# EasyEDA Pro project 通用ARM32位处理器开发板.epro, board PCB1
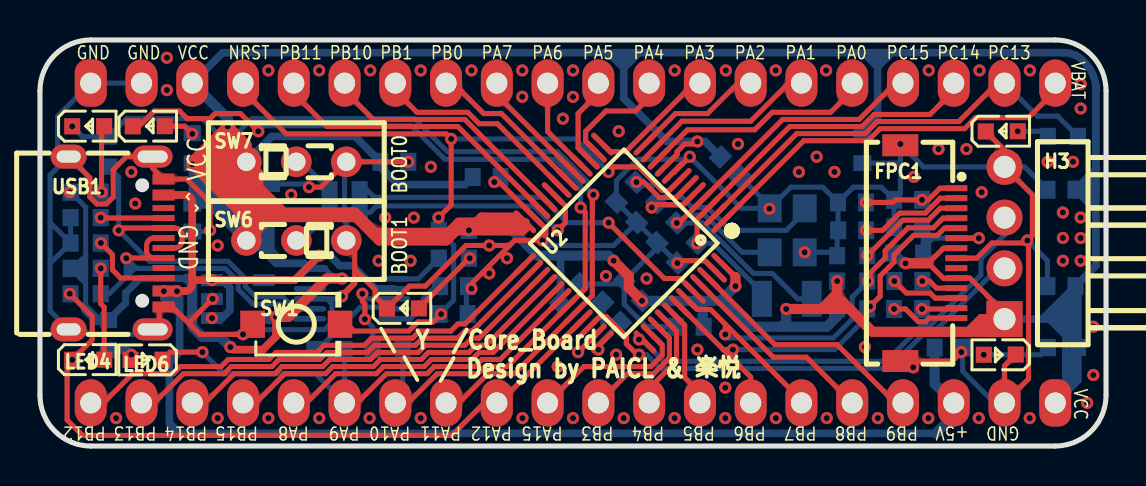
[diagram p1: board, top side]
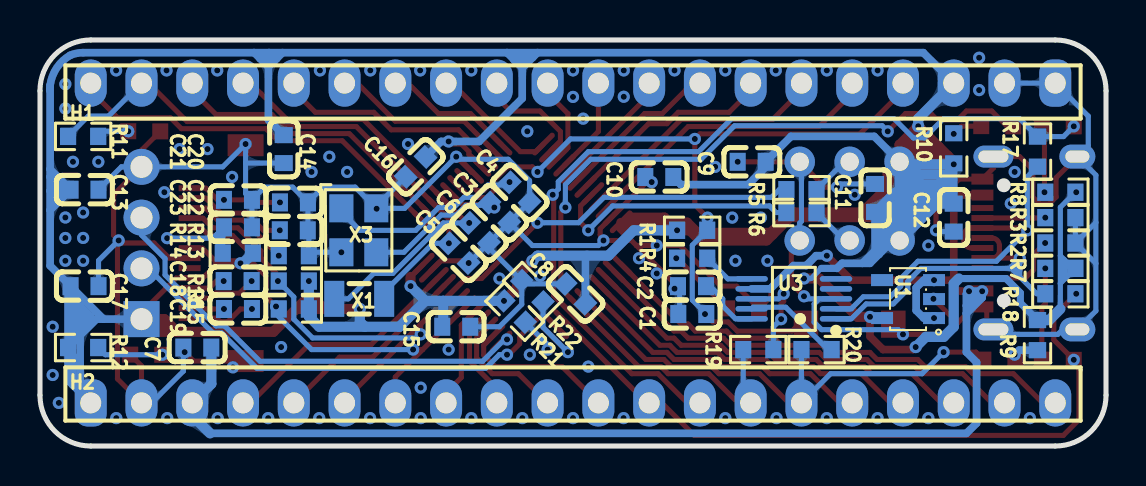
[diagram p2: board, bottom side, seen from below]

Outline 53.34 x 20.32 mm; copper layers: Top Layer, Bottom Layer. Coordinates in mm from the lower left corner of the outline.
Outline path: 0,17.78 0,2.54 arc(0.74,0.74) 2.54,0 50.8,0 arc(52.6,0.74) 53.34,2.54 53.34,17.78 arc(52.6,19.58) 50.8,20.32 2.54,20.32 arc(0.74,19.58) 0,17.78
Stack: Top Layer 0.035mm / Dielectric1 1.51mm FR4 er 4.5 / Bottom Layer 0.035mm

## Design rules (mm)
template: JLCPCB Capability(Two Layers Board)
spacing copperThickness1oz (default): track to track 0.102, other pairs 0.152 to 0.3
spacing copperThickness2oz: track to track 0.203, other pairs 0.152 to 0.3
track width copperThickness1oz (default): min 0.127, default 0.254, max 2.54
track width copperThickness2oz: min 0.203, default 0.254, max 2.54
differential pair differentialPair (default): width min 0.127, default 0.254, max 2.54; gap min 0.152, default 0.152
via viaSize (default): diameter min 0.5, default 0.61, max 10; hole min 0.3, default 0.305, max 6.3

## Placement (name value [footprint] x y rotation side)
C1  100nF  [C0603]  20.7 6.61 180 bottom
C2  100nF  [C0603]  20.72 8 0 bottom
C3  20pF  [C0603]  30.35 11.68 45 bottom
C4  20pF  [C0603]  29.34 12.7 45 bottom
C5  20pF  [C0603]  32.38 9.65 45 bottom
C6  20pF  [C0603]  31.37 10.67 45 bottom
C7  2.2uF  [C0603]  45.47 4.93 180 bottom
C8  2.2uF  [C0603]  26.54 7.62 45 bottom
C9  1uF  [C0603]  17.73 14.22 0 bottom
C10  1uF  [C0603]  22.35 13.46 180 bottom
C11  100nF  [C0603]  11.56 12.41 270 bottom
C12  100nF  [C0603]  7.62 11.43 270 bottom
C13  100nF  [C0603]  51.11 12.83 180 bottom
C14  100nF  [C0603]  41.14 14.86 270 bottom
C15  100nF  [C0603]  32.51 5.97 180 bottom
C16  100nF  [C0603]  34.54 13.97 315 bottom
C17  100nF  [C0603]  51.11 8 180 bottom
C18  1uF  [C0603]  43.45 8.25 0 bottom
C19  1uF  [C0603]  43.43 6.86 180 bottom
C20  4.7uF  [C0603]  40.63 12.19 180 bottom
C21  100nF  [C0603]  43.43 12.32 0 bottom
C22  2.2uF  [C0603]  40.64 10.8 0 bottom
C23  4.7uF  [C0603]  43.43 10.94 0 bottom
FPC1  FPC-05F-14PH15  [FPC-SMD_14P-P0.50_XUNPU_FPC-05F-14PH15]  44.45 9.65 270 top
H1  X6511WV-20H-C60D30  [hdr-th_20p-p2.54-v-m]  26.67 17.78 0 bottom
H2  X6511WV-20H-C60D30  [hdr-th_20p-p2.54-v-m]  26.67 2.54 180 bottom
H3  PZ254R-11-04P  [HDR-TH_4P-P2.54-H-M-W10.4]  48.26 10.16 90 top
LED1  XL-1608SURC-06  [LED0603-RD_RED]  48.02 4.57 180 top
LED2  XL-1608SURC-06  [LED0603-RD_RED]  48.12 15.75 0 top
LED3  XL-1608SURC-06  [LED0603-RD_RED]  18.16 6.88 0 top
LED4  XL-1608SURC-06  [LED0603-RD_RED]  2.41 4.32 0 top
LED5  XL-1608SURC-06  [LED0603-RD_RED]  2.41 16 0 top
LED6  XL-1608SURC-06  [LED0603-RD_RED]  5.33 4.32 180 top
LED7  XL-1608SURC-06  [LED0603-RD_RED]  5.44 16 0 top
R1  10kΩ  [R0603]  20.71 10.8 0 bottom
R2  5.1kΩ  [R0603]  2.29 10.16 180 bottom
R3  5.1kΩ  [R0603]  2.29 11.43 180 bottom
R4  510Ω  [R0603]  20.71 9.4 180 bottom
R5  10kΩ  [R0603]  15.24 12.83 180 bottom
R6  10kΩ  [R0603]  15.24 11.68 0 bottom
R7  10kΩ  [R0603]  2.29 8.89 180 bottom
R8  10kΩ  [R0603]  2.29 12.7 180 bottom
R9  10kΩ  [R0603]  3.43 5.55 90 bottom
R10  10kΩ  [R0603]  7.62 14.9 270 bottom
R11  10kΩ  [R0603]  51.18 15.49 0 bottom
R12  10kΩ  [R0603]  51.18 4.93 0 bottom
R13  560kΩ  [R0603]  40.64 9.53 180 bottom
R14  4.7kΩ  [R0603]  43.44 9.65 180 bottom
R15  4.7kΩ  [R0603]  40.64 6.86 0 bottom
R16  4.7kΩ  [R0603]  40.64 8.25 180 bottom
R17  0Ω  [R0603]  3.43 14.73 270 bottom
R18  0Ω  [R0603]  2.29 7.62 0 bottom
R19  0Ω  [R0603]  17.4 4.83 180 bottom
R20  0Ω  [R0603]  14.49 4.83 180 bottom
R21  0Ω  [R0603]  29.59 6.73 225 bottom
R22  0Ω  [R0603]  28.7 7.75 225 bottom
SW1  TS-1088R-02026  [SW-SMD_L3.9-W3.0-P4.45]  12.83 6.1 0 top
SW6  SS-12D01-G040  [SW-TH_SS-12D01-GX]  12.83 10.29 180 top
SW7  SS-12D01-G040  [SW-TH_SS-12D01-GX]  12.83 14.22 0 top
U1  SE5218ALG-LF  [SOT-23-5_L3.0-W1.7-P0.95-LS2.8-BR]  9.91 7.35 180 bottom
U2  STM32F103C8T6  [LQFP-48_L7.0-W7.0-P0.50-LS9.0-BL]  29.21 10.16 135 top
U3  CH340E  [MSOP-10_L3.0-W3.0-P0.50-LS5.0-BL]  15.62 7.37 90 bottom
USB1  TYPE-C 16PIN 2MD(073)  [USB-C-SMD_TYPE-C-6PIN-2MD-073]  3.81 10.16 270 top
X1  32.768kHz  [fc-135r_l3.2-w1.5]  37.37 7.37 180 bottom
X3  8MHz  [OSC-SMD_4P-L3.2-W2.5-BL]  37.38 10.8 270 bottom

## Footprints (pads in the part's own frame, mm; a bottom-side part is the same pattern mirrored in y, then rotated)
C0603
  rect 0.8x0.9 smd: 1(-0.7,0) 2(0.7,0)
fc-135r_l3.2-w1.5
  rect 1x1.8 smd: 1(-1.25,0) 2(1.25,0)
FPC-SMD_14P-P0.50_XUNPU_FPC-05F-14PH15
  rect 0.3x1.1 smd: 1(-3.25,1.4) 2(-2.75,1.4) 3(-2.25,1.4) 4(-1.75,1.4) 5(-1.25,1.4) 6(-0.75,1.4) 7(-0.25,1.4) 8(0.25,1.4) 9(0.75,1.4) 10(1.25,1.4) 11(1.75,1.4) 12(2.25,1.4) 13(2.75,1.4) 14(3.25,1.4)
  rect 1.1x1.8 smd: 15(5.4,-1.4) 16(-5.4,-1.4)
HDR-TH_4P-P2.54-H-M-W10.4
  rect 1.8x1.8 hole 1.1: 1(-3.81,0)
  round 1.8 hole 1.1: 2(-1.27,0) 3(1.27,0) 4(3.81,0)
hdr-th_20p-p2.54-v-m
  rrect 1.6x2.362 hole 1.05: 1(-24.13,-0.381)
  oval 1.6x2.362 hole 1.05: 2(-21.59,-0.381) 3(-19.05,-0.381) 4(-16.51,-0.381) 5(-13.97,-0.381) 6(-11.43,-0.381) 7(-8.89,-0.381) 8(-6.35,-0.381) 9(-3.81,-0.381) 10(-1.27,-0.381) 11(1.27,-0.381) 12(3.81,-0.381) 13(6.35,-0.381) 14(8.89,-0.381) 15(11.43,-0.381) 16(13.97,-0.381) 17(16.51,-0.381) 18(19.05,-0.381) 19(21.59,-0.381) 20(24.13,-0.381)
LED0603-RD_RED
  rect 0.8x0.8 smd: 1(-0.799,-0.004) 2(0.799,0.004)
LQFP-48_L7.0-W7.0-P0.50-LS9.0-BL
  oval 0.27x1.5 smd: 1(-2.75,-4.25) 2(-2.25,-4.25) 3(-1.75,-4.25) 4(-1.25,-4.25) 5(-0.75,-4.25) 6(-0.25,-4.25) 7(0.25,-4.25) 8(0.75,-4.25) 9(1.25,-4.25) 10(1.75,-4.25) 11(2.25,-4.25) 12(2.75,-4.25) 25(2.75,4.25) 26(2.25,4.25) 27(1.75,4.25) 28(1.25,4.25) 29(0.75,4.25) 30(0.25,4.25) 31(-0.25,4.25) 32(-0.75,4.25) 33(-1.25,4.25) 34(-1.75,4.25) 35(-2.25,4.25) 36(-2.75,4.25)
  oval 1.5x0.27 smd: 13(4.25,-2.75) 14(4.25,-2.25) 15(4.25,-1.75) 16(4.25,-1.25) 17(4.25,-0.75) 18(4.25,-0.25) 19(4.25,0.25) 20(4.25,0.75) 21(4.25,1.25) 22(4.25,1.75) 23(4.25,2.25) 24(4.25,2.75) 37(-4.25,2.75) 38(-4.25,2.25) 39(-4.25,1.75) 40(-4.25,1.25) 41(-4.25,0.75) 42(-4.25,0.25) 43(-4.25,-0.25) 44(-4.25,-0.75) 45(-4.25,-1.25) 46(-4.25,-1.75) 47(-4.25,-2.25) 48(-4.25,-2.75)
MSOP-10_L3.0-W3.0-P0.50-LS5.0-BL
  oval 0.28x1.62 smd: 1(-1,-2.11) 2(-0.5,-2.11) 3(0,-2.11) 4(0.5,-2.11) 5(1,-2.11) 6(1,2.11) 7(0.5,2.11) 8(0,2.11) 9(-0.5,2.11) 10(-1,2.11)
OSC-SMD_4P-L3.2-W2.5-BL
  rect 1.4x1.2 smd: 1(-1.1,-0.875) 2(1.1,-0.875) 3(1.1,0.875) 4(-1.1,0.875)
R0603
  rect 0.806x0.864 smd: 1(-0.753,0) 2(0.753,0)
SOT-23-5_L3.0-W1.7-P0.95-LS2.8-BR
  rect 1.1x0.6 smd: 1(1.3,-0.95) 2(1.3,0) 3(1.3,0.95) 4(-1.3,0.95) 5(-1.3,-0.95)
SW-SMD_L3.9-W3.0-P4.45
  rect 1.23x1.36 smd: 1(-2.185,0) 2(2.185,0)
SW-TH_SS-12D01-GX
  round 1.524 hole 0.914: 1(-2.5,0) 2(0,0) 3(2.5,0)
USB-C-SMD_TYPE-C-6PIN-2MD-073
  rect 0.55x1.1 smd: 1(-3.2,2.375) 2(-2.4,2.375) 11(2.4,2.375) 12(3.2,2.375)
  rect 0.3x1.1 smd: 3(-1.75,2.375) 4(-1.25,2.375) 5(-0.75,2.375) 6(-0.25,2.375) 7(0.25,2.375) 8(0.75,2.375) 9(1.25,2.375) 10(1.75,2.375)
  oval 1.1x2 hole 0.6x1.5: 13(-4.325,1.825) 14(4.325,1.825)
  oval 1.2x1.8 hole 0.6x1.2: 13(-4.325,-2.375) 14(4.325,-2.375)

## Nets
As in the schematic.

Pads without a net: FPC1 9; U1 4; U3 4 5; USB1 3 9

## Via types
v1: diameter 0.61, hole 0.305, Top Layer to Bottom Layer, 160 vias

## Routing (per net, layer and track width the routed paths; a pad name or vN(x,y) marks a point on that pad's centre or on a via; arc(x,y) is an arc through that point)
+5V: length 74.9
  Top Layer w0.381: USB1.2 7.25,12.56 arc(7.51,12.45) 7.62,12.19 7.62,8.34 ; v1(13.97,9.53) 12.75,8.3 v1(8.61,8.3) 7.66,8.3 arc(7.63,8.31) 7.62,8.34 ; 7.62,8.34 7.62,8.13 arc(7.51,7.86) 7.24,7.75 v1(6.86,7.75) ; v1(6.2,7.75) arc(6.19,7.75) USB1.11
  Bottom Layer w0.381: 6.26,7.75 v1(6.2,7.75) 6.2,7.42 6.98,6.63 ; 6.26,7.75 6.98,7.03 ; 6.26,7.75 v1(6.86,7.75) 6.98,7.62 6.98,7.03 ; 6.98,7.03 6.98,6.63 ; v1(8.61,6.4) 9.12,6.4 9.5,6.78 9.5,7.92 9.12,8.3 v1(8.61,8.3) ; v1(13.97,9.53) 14.51,9.53 15,9.03 15.64,9.03 16.8,7.87 U3.7 ; 6.98,6.63 6.98,4.7 6.48,4.19 6.48,1.14 6.98,0.64 44.83,0.64 ; 45.72,1.52 H2.3
  Bottom Layer w0.508: H2.3 44.77,3.11 C7.2 ; 44.83,0.64 45.72,1.52
GND: length 183.8
  Top Layer w0.254: 15.75,8.13 15.69,8.13 15.11,7.56 v1(15.11,7.49) 15.75,8.13 ; 15.75,8.13 15.75,8.67 ; 15.75,8.67 15.84,8.76 16.76,7.84 16.76,7.48 LED3.1 18.48,8 19.28,8 21.31,10.04 v1(22.48,10.04) 23.5,10.04 ; 15.75,8.67 15.75,9.87 SW6.1 ; SW1.1 10.13,5.59 8,5.59 7.43,6.16 ; 23.5,10.04 21.46,8 ; 23.5,10.04 23.75,10.29 25.02,10.29 25.31,10.58 25.31,10.88 U2.23 22.98,13.21 v1(22.73,13.21) ; v1(8.51,10.8) 8.51,12.19 7.34,13.36 USB1.1 5.64,13.91 USB1.13 4.33,14.48 3.67,13.83 3.67,12.46 3.32,12.12 2.84,12.12 2.5,12.46 2.5,13.42 USB1.13 ; 18.41,14.22 SW7.3 14.06,12.95 v1(13.46,12.95) ; U2.47 33.28,9.27 31.88,9.27 ; 49.46,10.35 49.46,3.36 H2.2 48.26,4.01 LED1.1 ; 49.46,10.35 49.66,10.54 49.66,12.57 H3.4 48.26,14.81 LED2.1 ; 49.46,10.35 49.28,10.16 47.62,10.16 46.87,9.4 FPC1.8 ; v1(32.51,14.48) 31.73,13.7 U2.8 ; v1(46.1,4.7) 45.65,4.25 FPC1.15 ; USB1.14 5.97,6.17 5.97,6.74 USB1.12 6.63,6.96 7.43,6.16 ; 7.43,6.16 v1(8.64,7.37)
  Bottom Layer w0.254: v1(38.26,9.69) 39.72,9.69 R13.2 39.89,10.74 C22.1 39.93,10.8 C20.2 ; C23.1 C21.1 ; C21.1 43.05,12.64 v1(43.05,15.11) 44.2,13.97 H3.4 49.27,13.97 C13.2 ; C21.1 42.1,12.95 40.69,12.95 C20.2 ; X3.4 36.51,12 35.04,13.47 ; X3.4 35.09,11.89 v1(32.51,14.48) 32.38,14.35 29.91,14.35 28.88,13.32 ; X3.4 37.57,12.95 39.17,12.95 C20.2 ; C1.1 21.34,6.67 21.34,7.62 v1(21.59,7.87) 21.46,8 C2.2 ; 25.02,10.29 v1(25.15,10.29) 25.4,10.03 28.7,10.03 29.86,11.19 ; v1(15.11,7.49) 14.99,7.37 14.35,7.37 ; 28.84,13.28 28.84,12.2 29.86,11.19 ; SW7.3 15.24,14.14 15.24,11.25 15.33,11.16 SW6.1 ; C17.2 50.41,9.28 v1(49.4,10.29) ; R2.2 0.51,11.18 ; R2.2 R3.2 ; R2.2 0.51,9.14 ; 0.51,11.18 0.51,13.56 USB1.13 0.89,15.03 0.89,16.51 H1.1 H1.2 ; 0.51,11.18 0.51,9.14 ; C11.1 13.3,13.11 v1(13.46,12.95) ; R22.1 29.07,8.11 27.04,8.11 ; R22.1 30.87,9.92 30.87,10.17 ; R22.1 29.23,7.09 30.35,5.97 C15.2 ; v1(8.51,10.8) 8.44,10.73 C12.2 ; 30.87,10.17 v1(31.89,9.16) ; 30.87,10.17 29.86,11.19 ; 14.35,7.37 14.6,7.11 14.6,6.2 14.23,5.82 10.4,5.82 v1(10.16,5.59) ; 14.35,7.37 U3.3 ; 41.14,14.16 43.05,14.16 ; 0.51,9.14 0.51,6.76 USB1.14 2.17,5.83 2.41,5.59 5.39,5.59 USB1.14 ; C7.1 46.17,3.75 47.75,2.16 H2.2
  vias: v1(3.81,1.4) v1(4.57,13.72) v1(4.77,12.13) v1(6.35,19.43) v1(6.35,17.81) v1(8.89,10.03) v1(8.89,1.4) v1(11.43,18.8) v1(11.43,1.4) v1(12.57,12.57) v1(13.97,18.8) v1(13.97,1.4) v1(16.52,18.8) v1(16.49,1.4) v1(16.94,9.27) v1(17.27,11.43) v1(18.43,14.22) v1(18.54,9.27) v1(18.7,11.43) v1(19.05,18.8) v1(19.05,1.4) v1(19.56,13.97) v1(21.59,18.8) v1(22.48,8.64) v1(23.37,9.4) v1(24.13,18.8) v1(24.13,17.48) v1(24.14,1.4) v1(25.9,3.97) v1(26.16,16.38) v1(26.67,18.8) v1(26.67,17.47) v1(26.67,1.4) v1(28.32,8.51) v1(28.83,4.57) v1(28.96,15.75) v1(29.21,1.4) v1(30.35,8.38) v1(31.76,18.8) v1(31.76,1.4) v1(32.89,4.83) v1(34.32,18.8) v1(34.29,2.92) v1(34.29,1.4) v1(34.93,15.11) v1(36.5,11.87) v1(36.81,18.8) v1(36.82,1.4) v1(37.97,13.72) v1(38.86,14.48) v1(39.33,18.8) v1(39.37,1.4) v1(39.75,13.72) v1(41.28,4.95) v1(41.92,1.4) v1(43.73,13.47) v1(43.69,3.94) v1(44.45,1.4) v1(44.47,18.8) v1(44.96,14.86) v1(46.35,14.86) v1(47.01,18.8) v1(46.97,1.4) v1(47.12,12.7) v1(49.53,18.8) v1(49.52,1.4) v1(50.42,14.22) v1(51.18,11.68) v1(51.18,10.41) v1(51.18,9.27) v1(51.69,14.22) v1(52.07,18.11) v1(52.07,16.89) v1(52.07,11.44) v1(52.07,10.41) v1(52.07,9.27) v1(52.4,2.16) v1(52.71,5.97) v1(52.71,3.56)
VBAT: length 19.7
  Top Layer w0.254: H1.20 50.8,17.78 49.45,16.43 46.81,16.43 46.26,15.88 42.03,15.88 41.43,15.28 38.22,15.28 U2.1
VCC: length 331.2
  Top Layer w0.254: 34.8,8.46 U2.48 ; H3.1 48.26,6.67 46.53,8.4 FPC1.10 45.83,8.38 45.21,8.38 44.45,9.14 45.21,9.9 FPC1.7 ; v1(32.89,15.24) 32.77,15.11 32.26,15.11 31.88,14.73 31.88,14.59 31.33,14.05
  Top Layer w0.381: v1(9.53,4.95) 9.65,4.83 11.15,4.83 11.81,5.48 v1(11.81,6.46)
  Top Layer w0.508: SW7.1 10.03,14.52 7.92,14.52 ; SW7.1 10.54,14.01 ; SW7.1 10.33,13.05 ; SW7.1 10.33,14.44 ; SW7.1 10.2,14.1 9.28,14.1 ; 10.33,12.22 10.33,11.9 ; 10.33,12.22 11.1,11.46 11.47,11.46 ; 10.33,12.22 10.33,12.6 ; 10.33,11.9 10.33,11.44 ; 10.33,11.9 8.38,13.84 ; 46.73,5.72 47.37,6.35 ; 46.73,5.72 47.62,5.72 H3.1 47.37,6.35 ; 46.73,5.72 46.48,5.72 ; 47.37,6.35 47.11,6.35 46.48,5.72 ; 8.91,15.52 8.37,14.98 ; 8.91,15.52 9.14,15.29 ; 8.91,15.52 9.14,15.75 ; 8.37,14.98 9.79,14.98 ; 8.37,14.98 7.92,14.52 ; 10.33,11.44 10.27,11.44 v1(7.62,14.1) ; 10.33,11.44 SW6.3 11.48,11.44 ; 10.33,11.44 10.94,11.44 ; 10.54,14.01 10.54,14.22 10.33,14.44 ; 10.54,14.01 10.54,12.83 11.68,11.68 11.94,11.68 ; 10.54,14.01 10.92,13.63 10.92,12.95 ; 15.58,11.68 15.76,11.68 16.78,10.67 ; 15.58,11.68 15.81,11.46 ; 15.58,11.68 12.19,11.68 10.92,12.95 ; v1(43.31,9.14) 44.45,9.14 ; 39.89,7.63 39.89,7.49 40.51,6.86 ; 39.89,7.63 39.6,7.34 ; 39.89,7.63 v1(39.89,8.25) ; 46.48,5.72 41.66,5.72 40.51,6.86 ; 10.33,13.05 9.28,14.1 ; 10.33,13.05 10.33,12.6 ; 9.28,14.1 8.69,14.1 ; 11.47,11.46 10.33,12.6 ; 11.47,11.46 11.5,11.46 ; 11.47,11.46 11.48,11.44 ; 10.33,12.6 10.19,12.6 8.69,14.1 ; v1(7.62,14.1) 7.62,14.22 7.92,14.52 ; v1(7.62,14.1) 8.69,14.1 ; v1(15.11,8.38) 14.35,8.38 12.43,6.46 v1(11.81,6.46) ; 40.51,6.86 40.07,6.86 ; 9.79,14.98 9.53,15.24 9.53,15.88 ; 9.79,14.98 10.23,14.98 10.33,15.07 ; 9.79,14.98 10.33,14.44 ; 9.14,15.29 9.14,15.24 ; 9.14,15.29 9.14,15.75 ; 9.53,15.88 v1(9.4,16) 9.14,15.75 ; 9.53,15.88 10.33,15.07 ; 10.92,12.95 10.92,12.83 ; v1(21.46,10.8) 24.13,10.8 24.26,10.92 24.26,11.17 ; v1(21.46,10.8) 21.84,11.18 ; v1(21.46,10.8) 20.83,10.8 20.32,10.29 16.98,10.29 16.69,10.58 ; v1(30.12,7.26) 29.46,7.92 29.46,8.51 v1(28.7,9.27) ; 39.12,6.86 v1(37.34,6.86) ; 39.12,6.86 39.6,7.34 ; 39.12,6.86 40.07,6.86 ; 10.94,11.44 10.54,11.05 ; 10.94,11.44 11.48,11.44 ; 10.33,14.44 10.33,15.07 ; 16.78,10.67 20.45,10.67 20.96,11.18 21.84,11.18 ; 16.78,10.67 16.69,10.58 ; 39.6,7.34 40.07,6.86 ; 11.5,11.46 15.81,11.46 ; 11.5,11.46 11.48,11.44 ; 21.89,11.22 21.84,11.18 ; 21.89,11.22 22.1,11.43 23.75,11.43 ; 21.89,11.22 24,11.22 ; 15.81,11.46 16.69,10.58 ; v1(34.8,8) 34.8,8.46
  Bottom Layer w0.254: 2.04,8.39 2.04,8.95 2.1,9.02 ; 2.04,8.39 R7.2 1.65,8.89 2.1,9.34 ; 2.04,8.39 2.1,8.45 2.1,9.02 ; 2.04,8.39 2.29,8.14 ; 2.1,9.34 2.1,9.02 ; 2.1,9.34 2.29,9.53 ; 2.29,9.53 2.29,8.14 ; 2.29,9.53 2.29,11.95 R8.2 ; 2.29,8.14 2.29,6.86 ; 14.25,8.89 14.76,8.38 v1(15.11,8.38)
  Bottom Layer w0.355: R9.2 4.29,7.16 4.29,7.67 5,8.38 7.37,8.38 ; 14.25,8.89 13.46,8.89
  Bottom Layer w0.381: 52.66,12.83 52.4,13.08 ; 52.66,12.83 52.4,12.83 ; 52.66,12.83 52.77,12.83 52.83,12.77 ; 52.4,13.08 52.4,12.83 ; 52.4,13.08 52.4,13.42 ; 52.4,13.08 52.79,13.47 52.83,13.47 ; 51.33,5.53 50.51,6.35 50.16,6.35 ; 51.33,5.53 51.81,5.05 ; 51.33,5.53 51.33,4.16 ; 51.81,5.05 C17.1 ; 51.81,5.05 R12.2 ; 41.5,19.39 41.91,19.39 ; 41.5,19.39 41.91,18.98 ; 41.5,19.39 41.2,19.69 ; 41.91,19.39 41.91,18.98 ; 41.91,19.39 41.91,19.65 41.88,19.69 ; 41.91,19.39 42.32,19.39 ; 11.2,11.16 11.3,11.05 11.3,9.91 11.04,10.17 11.04,11 ; 11.2,11.16 11.04,11 ; 11.2,11.16 11.56,11.52 ; 11.2,11.16 11.1,11.25 ; 11.04,11 SW6.3 10.67,10.29 11.37,9.59 ; 11.56,9.78 12.19,9.14 ; 11.56,9.78 11.56,11.52 ; 11.56,9.78 11.37,9.59 ; 12.19,9.14 11.81,9.14 11.37,9.59 ; 12.19,9.14 13.21,9.14 13.46,8.89 ; 52.83,13.85 52.4,13.42 ; 52.83,13.85 52.83,18.05 ; 52.83,13.85 52.83,13.47 ; 52.4,13.42 C13.1 ; C13.1 52.4,12.83 ; C13.1 52.45,12.19 ; 52.4,12.83 52.4,12.75 52.58,12.57 52.45,12.57 52.45,12.19 ; 42.62,19.69 51.18,19.69 arc(51.51,19.65) 51.83,19.55 arc(52.51,18.92) 52.83,18.05 ; 42.62,19.69 42.32,19.39 ; 42.62,19.69 41.88,19.69 ; R12.2 51.93,3.29 51.69,3.05 ; R12.2 51.93,7.88 C17.1 ; 11.56,11.52 C11.2 ; 52.83,11.81 52.83,9.02 C17.1 ; 52.83,11.81 52.45,12.19 ; 52.83,11.81 52.83,12.77 ; 42.32,19.39 41.91,18.98 ; 41.88,19.69 41.2,19.69 ; H3.1 50.16,6.35 ; 50.16,6.35 51.56,7.75 ; 29.21,18.92 29.46,19.18 ; 29.21,18.92 28.96,19.18 ; 29.21,18.92 29.21,17.4 31.37,15.24 v1(32.89,15.24) 33.27,15.24 34.05,14.47 ; 29.46,19.18 29.62,19.33 ; 29.46,19.18 28.96,19.18 ; 10.33,11.83 10.44,11.71 11.02,11.71 ; 11.34,11.5 11.1,11.25 ; 11.1,11.25 10.33,10.48 ; C10.2 21.27,13.08 17.91,13.08 17.03,13.96 C9.1 15.76,15.49 11.6,15.49 SW7.1 ; 29.62,19.33 29.5,19.45 28.68,19.45 ; 29.62,19.33 29.97,19.69 ; 41.91,18.98 41.91,16.33 C14.1 ; C17.1 51.56,7.75 ; 52.83,13.47 52.83,12.77 ; 51.33,2.69 51.69,3.05 ; 51.33,2.69 H2.1 ; 51.33,2.69 51.33,4.16 ; 51.69,3.05 51.69,4.44 51.61,4.44 51.33,4.16 ; 28.45,19.69 29.97,19.69 ; 28.45,19.69 28.68,19.45 ; 28.45,19.69 9.14,19.69 H1.3 ; 29.97,19.69 41.2,19.69 ; 51.44,7.11 51.31,6.98 ; 51.31,6.98 51.31,6.22 51.05,6.48 ; 51.31,6.98 50.8,6.48 51.56,5.72 51.56,7.75 ; 28.68,19.45 28.96,19.18 ; 52.83,18.05 arc(52.85,17.91) 52.85,17.78 ; 26.05,7.12 26.05,9.44 25.97,9.53 ; R10.2 7.62,14.14 C12.1
  Bottom Layer w0.508: v1(37.34,6.86) 37.34,6.22 37.08,5.97 ; 7.37,8.38 7.62,8.13 7.62,5.96 8.12,5.46 9.02,5.46 v1(9.53,4.95) ; 11.51,11.71 C11.2 11.34,11.5 10.33,11.5 ; 11.51,11.71 11.02,11.71 10.67,12.06 ; 11.51,11.71 10.53,12.69 10.33,12.69 ; v1(21.46,10.8) 23.63,10.8 24.9,9.53 28.45,9.53 v1(28.7,9.27) ; 9.4,13.59 7.87,13.59 7.87,12.7 8,12.57 8.64,12.57 9.14,12.06 ; 9.4,13.59 9.4,13.21 9.53,13.08 9.53,11.3 ; 9.4,13.59 9.65,13.84 ; 10.33,11.2 10.33,10.88 ; 10.33,11.2 10.43,11.1 10.94,11.1 ; 10.33,11.2 10.33,11.5 ; 10.33,10.88 9.91,11.3 ; 10.33,10.88 SW6.3 9.42,11.2 ; 9.14,12.06 9.14,13.08 8.38,13.08 8.25,13.21 8.25,12.95 ; 9.14,12.06 9.27,11.94 ; R14.2 43.2,9.14 v1(43.31,9.14) ; 33.16,7.26 v1(30.12,7.26) ; 33.16,7.26 33.16,6.02 C15.1 ; 33.16,7.26 34.06,7.26 ; 10.33,12.69 SW7.1 10.2,14.1 v1(7.62,14.1) ; 10.33,12.69 10.33,11.5 ; 34.06,7.26 v1(34.8,8) ; 34.06,7.26 35.36,5.97 37.08,5.97 ; R9.2 2.84,6.3 2.29,6.86 ; 8.25,12.95 8.64,12.95 8.89,12.7 ; 8.25,12.95 8.13,12.83 ; 9.91,11.3 10.03,11.3 9.91,11.43 9.91,13.46 9.78,13.33 9.78,11.43 9.91,11.3 ; 9.91,11.3 9.53,11.3 ; C12.1 8.48,12.13 9.42,11.2 ; 9.42,11.2 9.53,11.3 ; v1(39.89,8.25) 39.89,6.49 39.37,5.97 37.08,5.97 ; H1.3 9.4,16.38 v1(9.4,16)
  vias: v1(1.49,12.7)
BOOT0: length 18.9
  Top Layer w0.254: v1(28.45,11.18) 31.24,8.38 32.05,8.38 32.75,7.69
  Bottom Layer w0.254: R5.1 16.35,12.83 16.73,12.45 25.12,12.45 26.39,11.18 v1(28.45,11.18)
C1N: length 1.8
  Top Layer w0.254: v1(44.15,8.25) 44.51,8.25 44.86,7.9 FPC1.11
C1P: length 3.5
  Top Layer w0.254: FPC1.12 44.79,7.4 44.54,7.66 43.35,7.66 v1(42.75,8.25)
C2N: length 1.7
  Top Layer w0.254: v1(44.13,6.86) 45.81,6.86 FPC1.13
C2P: length 3.5
  Top Layer w0.254: FPC1.14 44.5,6.4 44.32,6.22 43.94,6.22 43.31,6.86 v1(42.73,6.86)
NRST: length 40.1
  Top Layer w0.254: SW1.2 15.37,6.1 15.71,5.75 18.45,5.75 18.91,6.21 19.67,6.21 v1(20.07,6.6) ; v1(28.45,13.72) 28.7,13.97 29.95,13.97 31.13,12.79 31.49,12.79 U2.7 ; H1.4 10.16,17.78 12.32,15.62 20.32,15.62 v1(20.57,15.37) 20.57,12.06 v1(19.94,11.43) 19.94,11.3
  Bottom Layer w0.254: 19.96,10.8 20.7,10.05 20.7,7.31 C1.2 ; v1(28.45,13.72) 26.8,15.37 v1(20.57,15.37)
  Bottom Layer w0.508: 19.96,10.8 19.96,11.41 v1(19.94,11.43)
OSC_IN: length 9.1
  Top Layer w0.254: v1(30.61,11.94) 30.75,12.08 32.19,12.08 32.75,12.64
  Bottom Layer w0.254: 30.85,12.18 30.98,12.04 32.03,12.04 32.51,11.56 33.27,11.56 35.13,9.69 X3.3
OSC_OUT: length 13.1
  Top Layer w0.254: U2.6 31.84,12.44 30.98,12.44 30.21,13.21 v1(29.84,13.21)
  Bottom Layer w0.254: X3.1 38.26,11.72 37.34,10.8 34.53,10.8 33.39,11.94 32.63,11.94 32.13,12.45 31.54,12.45 30.93,13.06 29.99,13.06 v1(29.84,13.21)
PA0: length 11.4
  Top Layer w0.254: U2.10 32.4,15.82 35.76,15.82 36.64,16.7 39.56,16.7 40.64,17.78 H1.16
PA1: length 8.9
  Top Layer w0.254: U2.11 32.12,16.26 35.56,16.26 37.47,18.16 H1.15
PA2: length 6.6
  Top Layer w0.254: U2.12 31.8,16.64 33.4,16.64 34.93,18.16 H1.14
PA3: length 6.4
  Top Layer w0.254: U2.13 28.53,14.73 29.31,14.73 32.74,18.16 H1.13
PA4: length 5.8
  Top Layer w0.254: H1.12 30.48,17.44 29.8,16.76 28.32,16.76 27.3,15.74 27.3,15.25 U2.14
PA5: length 4.4
  Top Layer w0.254: U2.15 26.92,14.92 26.92,16.64 27.94,17.65 H1.11
PA6: length 4.8
  Top Layer w0.254: H1.10 25.4,15.74 27.09,14.05
PA7: length 6.1
  Top Layer w0.254: U2.17 22.86,17.57 H1.9
PA8: length 15.3
  Top Layer w0.254: H2.16 13.33,2.16 14.79,3.62 16.83,3.62 17.18,3.97 19.22,3.97 19.58,4.33 21.62,4.33 21.97,4.69 22.68,4.69 25.67,7.69
PA9/USART0_TX: length 25.9
  Top Layer w0.254: H2.15 15.87,2.16 17.33,3.62 19.37,3.62 19.73,3.97 21.76,3.97 22.12,4.33 23.03,4.33 U2.30 ; LED6.1 6.51,4.7 v1(8.13,4.7)
  Bottom Layer w0.254: 15.24,4.83 H2.15 13.78,3.62 9.21,3.62 v1(8.13,4.7)
PA10/USART0_RX: length 44.7
  Top Layer w0.254: v1(10.92,15.75) 10.03,16.64 8.76,16.64 8.51,16.38 7.37,16.38 6.98,16.76 5.72,16.76 4.95,16 LED7.1 ; H2.14 18.41,2.16 19.87,3.62 21.91,3.62 22.27,3.97 23.38,3.97 U2.31 27.28,7.88 27.28,11.71 v1(27.05,11.94)
  Bottom Layer w0.254: H2.14 18.15,2.53 R19.1 ; v1(27.05,11.94) 27.05,13.08 ; 27.05,13.08 25.78,14.35 20.26,14.35 18.58,16.03 11.2,16.03 v1(10.92,15.75)
PA11/USB_D-: length 43.9
  Top Layer w0.254: v1(27.69,12.57) 27.63,12.52 27.63,7.52 U2.32 23.73,3.62 22.41,3.62 20.95,2.16 H2.13
  Bottom Layer w0.254: v1(27.69,12.57) 27.41,12.85 27.41,13.23 25.9,14.73 20.38,14.73 18.73,16.38 10.6,16.38 9.64,15.42 9.09,15.42 8.13,16.38 4.33,16.38 R17.1 2.13,15.49 v1(1.61,16)
PA12/USB_D+: length 35.7
  Top Layer w0.254: v1(1.49,7.62) 2.61,6.5 2.61,5.32 v1(1.61,4.31) 1.36,4.06 1.36,1.31 2.14,0.53 20.6,0.53 22.23,2.16 H2.12 22.98,2.16 27.09,6.27
PA13/SWDIO: length 24.4
  Top Layer w0.254: U2.34 27.99,6.47 28.35,6.47 29.34,5.48 29.34,5.12 29.88,4.57 v1(29.97,4.57)
  Bottom Layer w0.254: v1(29.97,4.57) 30.36,4.57 31.04,3.89 42.48,3.89 44.25,5.66 44.68,5.66 47.91,8.89 H3.2
PA14/SWCLK: length 23.1
  Top Layer w0.254: U2.37 30.1,5.21 v1(29.97,5.33)
  Bottom Layer w0.254: H3.3 48.26,10.56 47.08,9.38 47.08,8.56 44.53,6.01 44.1,6.01 42.33,4.24 31.19,4.24 30.1,5.33 v1(29.97,5.33)
PA15: length 8
  Top Layer w0.254: U2.38 31.14,5.05 31.14,4.55 30.56,3.97 27.22,3.97 H2.11
PB0: length 8.1
  Top Layer w0.254: H1.8 20.68,18.16 22.2,16.64 23.09,16.64 U2.18
PB1: length 10.6
  Top Layer w0.254: H1.7 17.78,17.78 18.86,16.7 21.4,16.7 21.98,16.13 22.89,16.13 U2.19
PB2/BOOT1: length 12.8
  Top Layer w0.254: 25.67,12.64 26.29,12.02 26.29,11.18 v1(25.91,10.8)
  Bottom Layer w0.254: v1(25.91,10.8) 24.69,12.01 16.84,12.01 16.51,11.68 R6.2
PB3: length 6.2
  Top Layer w0.254: H2.10 29.4,3.62 30.71,3.62 31.49,4.4 31.49,5.4 U2.39
PB4: length 4.9
  Top Layer w0.254: H2.9 30.48,2.89 31.85,4.26 31.85,5.75 31.33,6.27
PB5: length 5
  Top Layer w0.254: U2.41 32.26,6.05 32.26,3.43 33.02,2.67 H2.8
PB6/SCL: length 21.6
  Top Layer w0.254: 34.19,4.83 35.56,3.46 H2.7 ; 34.19,4.83 U2.42 ; 34.19,4.83 v1(34.67,4.83) ; v1(41.53,6.98) 42.04,7.49 42.04,8.51 42.72,9.2 42.72,9.56 43.71,10.54 44.89,10.54 45.25,10.9 FPC1.5
  Bottom Layer w0.254: v1(41.53,6.98) 41.53,6.6 39.75,4.83 34.54,4.83
PB7/SDA: length 23.6
  Top Layer w0.254: 34.29,6.1 33.55,6.84 32.89,6.84 U2.43 ; 34.29,6.1 38.1,2.29 H2.6 ; 34.29,6.1 v1(34.29,5.59) ; v1(41.44,8.25) 41.53,8.35 41.53,8.65 42.29,9.41 42.29,9.77 43.44,10.92 44.7,10.92 45.18,11.4 FPC1.4
  Bottom Layer w0.254: v1(41.44,8.25) 40.64,7.46 40.64,6.35 39.7,5.41 34.47,5.41 v1(34.29,5.59)
PB8: length 10
  Top Layer w0.254: H2.5 38.35,4.44 36.69,4.44 U2.45
PB9: length 12.3
  Top Layer w0.254: U2.46 36.76,5.08 39.88,5.08 42.8,2.16 H2.4
PB10: length 12.7
  Top Layer w0.254: U2.21 21.26,16.34 16.68,16.34 15.24,17.78 H1.6
PB11: length 15.1
  Top Layer w0.254: H1.5 12.7,17.65 14.36,15.99 20.91,15.99 U2.22
PB12: length 24.6
  Top Layer w0.254: H2.20 3.17,2.16 4.63,3.62 6.67,3.62 7.03,3.97 9.06,3.97 9.42,4.33 11.46,4.33 11.81,4.69 13.85,4.69 14.2,5.04 16.24,5.04 16.59,5.4 18.63,5.4 18.99,5.75 20.55,5.75 20.91,6.11 21.27,6.11 U2.25
PB13: length 22.3
  Top Layer w0.254: H2.19 5.71,2.16 7.17,3.62 9.21,3.62 9.57,3.97 11.6,3.97 11.96,4.33 14,4.33 14.35,4.69 16.39,4.69 16.74,5.04 18.78,5.04 19.14,5.4 20.91,5.4 21.26,5.75 21.62,5.75 U2.26
PB14: length 19.9
  Top Layer w0.254: H2.18 8.25,2.16 9.71,3.62 11.75,3.62 12.11,3.97 14.14,3.97 14.5,4.33 16.53,4.33 16.89,4.69 18.93,4.69 19.28,5.04 21.26,5.04 21.61,5.4 21.97,5.4 U2.27
PB15: length 17.6
  Top Layer w0.254: H2.17 10.79,2.16 12.25,3.62 14.29,3.62 14.65,3.97 16.68,3.97 17.04,4.33 19.08,4.33 19.43,4.69 21.47,4.69 21.82,5.04 22.32,5.04 U2.28
PC13: length 22
  Top Layer w0.254: U2.2 37.87,15.63 41.28,15.63 41.89,16.24 45.98,16.24 47.9,18.16 H1.19
  Bottom Layer w0.254: H1.19 49.91,16.51 50.92,16.51 R11.2
PC14/OSC32_IN: length 21.7
  Top Layer w0.254: H1.18 45.72,17.78 44.53,16.59 41.74,16.59 41.14,15.99 37.51,15.99 U2.3 32.88,11.36 v1(32.88,10.15)
  Bottom Layer w0.254: X1.2 36.12,7.7 33.67,10.15 v1(32.88,10.15)
PC15/OSC32_OUT: length 22.5
  Top Layer w0.254: H1.17 42.81,18.16 40.99,16.34 37.16,16.34 U2.4 31.98,11.16 v1(31.86,11.16)
  Bottom Layer w0.254: v1(31.86,11.16) 33.16,11.16 35.69,8.64 36.64,8.64 37.91,7.37 X1.1
RES#: length 6.9
  Top Layer w0.254: FPC1.6 v1(46.98,10.4) 46.99,10.41
  Bottom Layer w0.254: 44.68,10.4 44.48,10.6 ; 44.68,10.4 v1(46.98,10.4) ; 44.68,10.4 44.48,10.2 ; 44.48,10.6 44.48,10.2 ; 44.48,10.6 44.19,10.88 ; 44.48,10.2 44.19,9.92 ; 44.48,10.2 44.19,10.49 ; 44.19,9.92 R14.1 ; 44.19,9.92 44.19,10.49 ; 44.19,10.49 44.19,10.88 ; 44.19,10.88 C23.2
USART0_RX: length 4.7
  Top Layer w0.254: v1(16.26,6.35) 16.26,7.11 16.13,7.24 v1(16.13,7.62)
  Bottom Layer w0.254: R19.2 16.65,5.96 v1(16.26,6.35) ; U3.8 16.38,7.37 v1(16.13,7.62)
USART0_TX: length 4.9
  Bottom Layer w0.254: R20.2 13.91,4.83 16.03,6.95 17.65,6.95 U3.9
USB_D+: length 18.1
  Top Layer w0.254: v1(4.32,9.4) 4.33,9.41 5.7,9.41 ; USB1.6 5.71,10.41 arc(5.44,10.3) 5.33,10.03 5.33,9.78 arc(5.44,9.52) 5.7,9.41 ; USB1.8 5.7,9.41
  Bottom Layer w0.254: 4.32,8.79 v1(4.32,9.4) 4.62,9.09 ; 4.32,8.79 4.32,8.47 ; 4.32,8.79 4.62,9.09 ; 4.32,8.47 4.74,8.89 4.83,8.89 ; 4.32,8.47 3.47,7.62 R18.2 ; U3.1 12.75,6.37 12,7.11 10.65,7.11 9.92,7.84 9.92,8.24 9.26,8.89 4.83,8.89 ; 4.83,8.89 4.62,9.09
USB_D-: length 19.7
  Top Layer w0.254: USB1.7 6.73,9.91 arc(7,10.02) 7.11,10.29 7.11,10.54 arc(7,10.8) 6.74,10.91 USB1.5 4.05,10.91 v1(3.94,10.8)
  Bottom Layer w0.254: R17.2 3.94,13.47 v1(3.94,10.8) 5.49,9.25 9.41,9.25 10.27,8.38 10.27,7.99 10.8,7.47 12.15,7.47 12.75,6.87 U3.2
$1N2106: length 3.2
  Bottom Layer w0.254: U3.10 18.54,6.37 19.18,7.01 19.18,7.37 19.81,8 C2.1
$1N2935: length 3.1
  Top Layer w0.254: USB1.4 3.05,11.41
  vias: v1(3.04,11.43)
$1N2938: length 4.3
  Top Layer w0.254: USB1.10 4.04,8.41 3.62,8.82 3.62,9.58 v1(3.05,10.16)
  Bottom Layer w0.254: v1(3.05,10.16) R2.1
$1N3166: length 2.7
  Bottom Layer w0.254: U3.6 18.92,8.37 19.96,9.4
$1N3169: length 3.5
  Top Layer w0.254: LED3.2 18.96,6.9 21.46,9.4
  vias: v1(21.5,9.4)
$1N4228: length 2.2
  Bottom Layer w0.254: SW7.2 13.09,14.22 R5.2
$1N4237: length 2.2
  Bottom Layer w0.254: SW6.2 13.09,10.29 R6.1
$1N6427: length 4.6
  Top Layer w0.254: LED4.2 3.21,6.95 3.04,7.12 v1(3.04,8.89)
$1N6466: length 3.4
  Top Layer w0.254: v1(3.08,12.7) 3.08,15.87 LED5.2
$1N6674: length 1.2
  Bottom Layer w0.381: v1(4.57,4.57) 4.35,4.8 R9.1
$1N6676: length 1.5
  Top Layer w0.254: LED7.2 7.24,16.01 v1(7.62,15.62)
$1N10384: length 3.4
  Bottom Layer w0.254: v1(47.22,4.57) 50.07,4.57 R12.1
$1N10388: length 1.6
  Bottom Layer w0.254: v1(48.92,15.75) 50.17,15.75 R11.1
$1N10989: length 4.8
  Top Layer w0.254: v1(41.33,12.19) 42.67,12.19 42.8,12.32 v1(44.13,12.32) 44.45,12.32 45.03,12.9 FPC1.1
$1N10994: length 5.2
  Top Layer w0.254: v1(41.34,10.8) 42.16,10.8 43.02,11.66 44.3,11.66 45.04,12.4 FPC1.2
$1N11001: length 5.4
  Top Layer w0.254: v1(41.39,9.53) 43.17,11.3 44.45,11.3 45.05,11.9 FPC1.3
$1N13630: length 1.8
  Bottom Layer w0.254: R21.2 27.94,5.08 v1(27.94,4.83)
$1N13674: length 4.3
  Top Layer w0.254: v1(26.92,4.7) 26.93,4.7 U2.35
  Bottom Layer w0.254: R22.2 28.17,5.94 v1(26.92,4.7)

## Copper pours and planes (outline as drawn; the poured copper is in the pictures)
GND on Top Layer: -21.08,30.1 73.03,30.1 73.03,-7.24 -21.08,-7.24
GND on Bottom Layer: -6.08,-31.42 -6.08,62.69 56.41,62.69 56.41,-31.42

Small or netless copper shapes (teardrops, artwork), in the pictures only: 236 on Top Layer, 254 on Bottom Layer

## Text on the board
Top Silkscreen Layer: GND | VCC | NRST | PB11 | PB10 | PB1 | PB0 | PA7 | PA6 | PA5 | PA4 | PA3 | PA2 | PA1 | PA0 | PC15 | PC14 | PC13 | PB12 | PB13 | PB14 | PB15 | PA8 | PA9 | PA10 | PA11 | PA12 | PA15 | PB3 | PB4 | PB5 | PB6 | PB7 | PB8 | PB9 | +5V | VBAT | BOOT0 | BOOT1 | ^ VCC | ^ GND | \  Y  /Core_Board / \  / Design by PAICL & 楽悦
